# Altium schematic sheet RF-433RX.SchDoc: RF-433M-RXTX
size A4; DrawnBy: ZWM; Revision: V1.0; Time: 2020-06-11
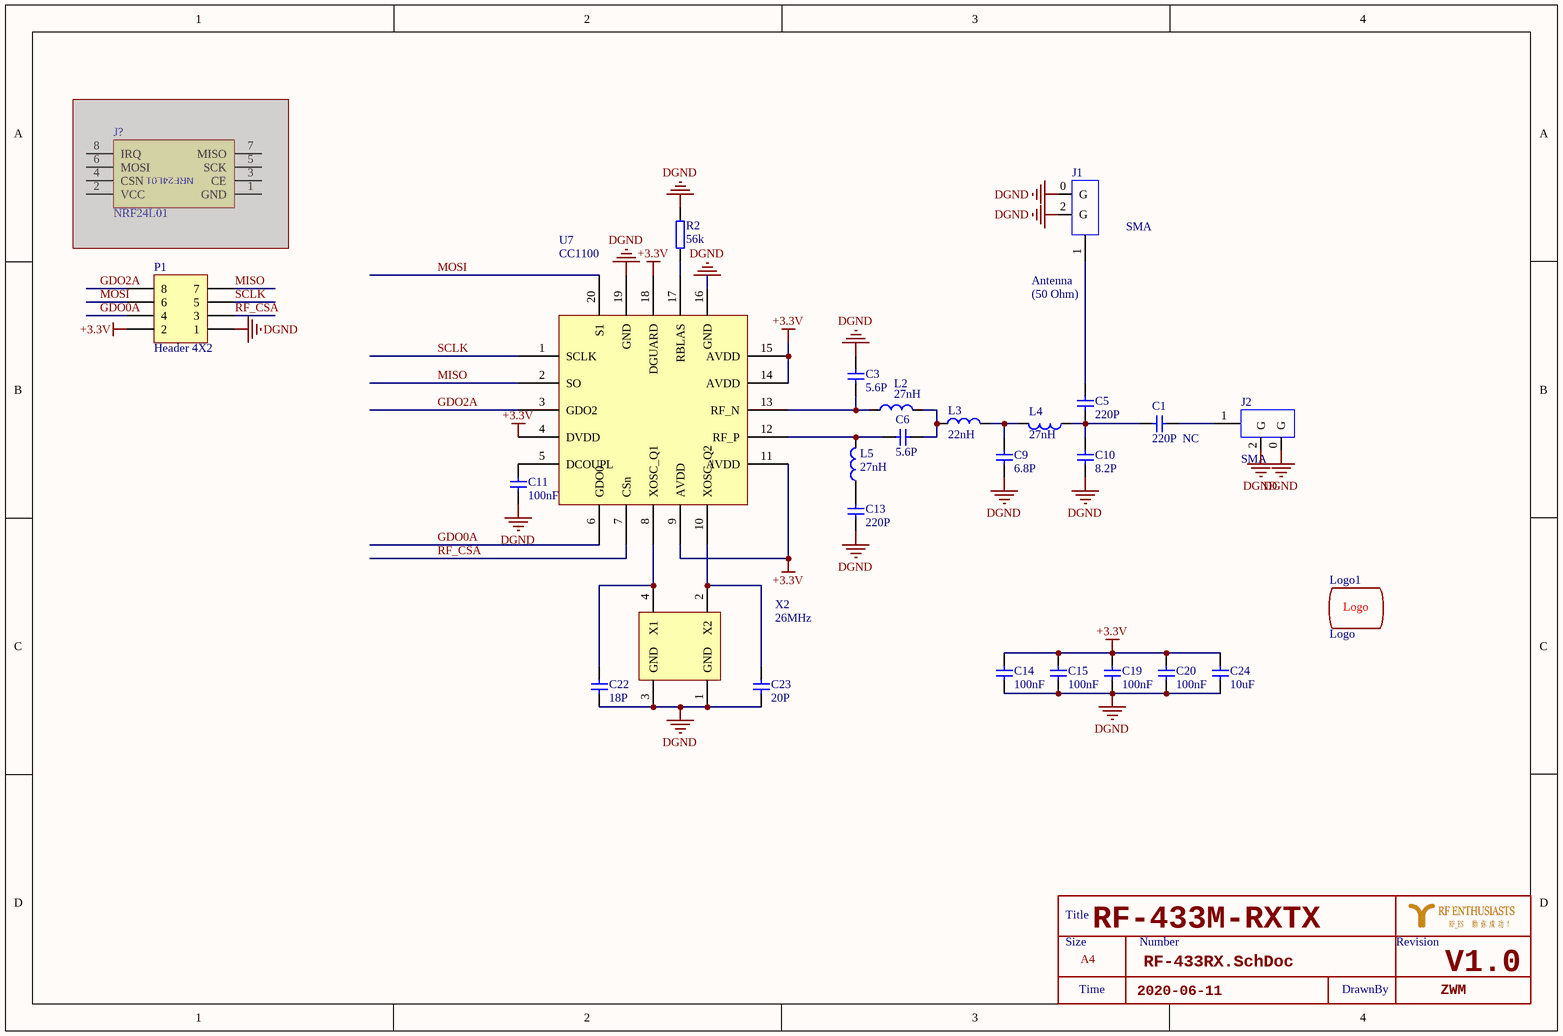
[diagram p0: RF-433RX.SchDoc]

## Parts
C1  220P  NC  [CAP0402]
C3  5.6P  [cc0402]
C5  220P  [cc0402]
C6  5.6P  [cc0402]
C9  6.8P  [cc0402]
C10  8.2P  [cc0402]
C11  100nF  [cc0402]
C13  220P  [cc0402]
C14  100nF  [cc0402]
C15  100nF  [cc0402]
C19  100nF  [cc0402]
C20  100nF  [cc0402]
C22  18P  [cc0402]
C23  20P  [cc0402]
C24  10uF  [cc0603]
J1  SMA  [SMA-ANT-SMT-MIN]
J2  SMA  [IPEX]
J?  NRF24L01  [NRF24L01]  (masked out: inside a compile mask, not in the netlist)
L2  27nH  [ind0402]
L3  22nH  [ind0402]
L4  27nH  [ind0402]
L5  27nH  [ind0402]
Logo1  Logo  [Logo_SiTuo_14mmX5mm]
P1  Header 4X2  [HDR2X4-Z]
R2  56k  [res0402]
U7  CC1100  [QFN-20]
X2  26MHz  [XTAL-2X3]

## Nets
+3.3V: C14.2 C15.1 C19.1 C20.2 C24.2 P1.2 U7.4(DVDD) U7.9(AVDD) U7.11(AVDD) U7.14(AVDD) U7.15(AVDD) U7.18(DGUARD)
DGND: C3.1 C9.1 C10.2 C11.2 C13.2 C14.1 C15.2 C19.2 C20.1 C22.2 C23.1 C24.1 J1.0(G) J1.2(G) J2.0(G) J2.2(G) P1.1 R2.1 U7.16(GND) U7.19(GND) X2.1(GND) X2.3(GND)
GDO0A: P1.4 U7.6(GDO0)
GDO2A: P1.8 U7.3(GDO2)
MISO: P1.7 U7.2(SO)
MOSI: P1.6 U7.20(S1)
RF_CSA: P1.3 U7.7(CSn)
SCLK: P1.5 U7.1(SCLK)
NetC1_1: C1.1 C5.2 C10.1 L4.1
NetC1_2: C1.2 J2.1
NetC3_2: C3.2 L2.1 U7.13(RF_N)
NetC5_1: C5.1 J1.1
NetC6_1: C6.1 L5.2 U7.12(RF_P)
NetC6_2: C6.2 L2.2 L3.1
NetC9_2: C9.2 L3.2 L4.2
NetC11_1: C11.1 U7.5(DCOUPL)
NetC13_1: C13.1 L5.1
NetC22_1: C22.1 U7.8(XOSC_Q1) X2.4(X1)
NetC23_2: C23.2 U7.10(XOSC_Q2) X2.2(X2)
NetR2_2: R2.2 U7.17(RBLAS)

## Notes on the sheet
- (near J1) Antenna
- (50 Ohm)
- Title
- Size
- A4
- Number
- Revision
- Time
- DrawnBy

## Library data of the parts
C1 C3 C5 C6 C9-C11 C13-C15 C19 C20 C22-C24 = CAP
L2-L5 = INDUCTOR
P1 = Header 4X2: Header, 4-Pin, Dual row; LatestRevisionDate: 17-Jul-2002; LatestRevisionNote: Re-released for DXP Platform.; Publisher: Altium Limited
R2 = RES
U7 = Component_1
X2 = XO53